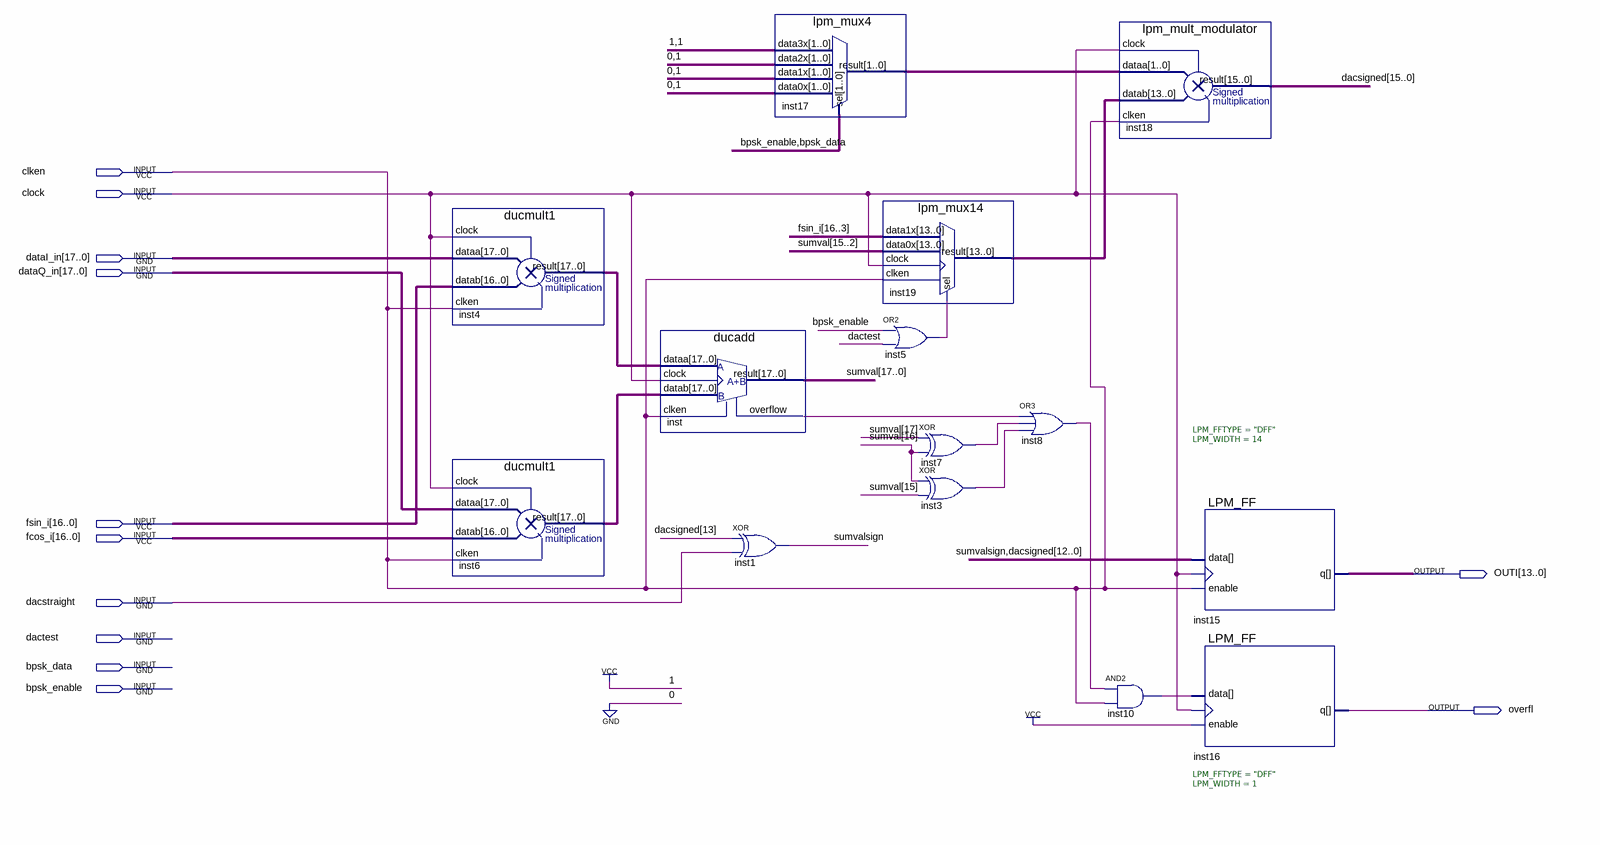
[diagram p0: schematic sheet]
// Quartus schematic duc_mux.bdf as structural Verilog: 14 symbols, 12 pins
module duc_mux (
  input  clken,
  input  clock,
  input  [17:0] dataI_in,
  input  [17:0] dataQ_in,
  input  [16:0] fsin_i,
  input  [16:0] fcos_i,
  input  dacstraight,
  input  dactest,
  input  bpsk_data,
  input  bpsk_enable,
  output [13:0] OUTI,
  output overfl
);

  wire inst3_out, inst5_out, inst7_out, inst8_out, inst10_out, inst_overflow, sumvalsign;
  wire [1:0] inst17_result;
  wire [13:0] inst19_result;
  wire [15:0] dacsigned;
  wire [17:0] inst4_result, inst6_result, sumval;

  ducmult1 inst4 (.clock(clock), .dataa(dataI_in), .datab(fsin_i), .clken(clken), .result(inst4_result));
  ducmult1 inst6 (.clock(clock), .dataa(dataQ_in), .datab(fcos_i), .clken(clken), .result(inst6_result));
  ducadd inst (
    .dataa(inst4_result), .datab(inst6_result), .clken(clken), .clock(clock), .result(sumval),
    .overflow(inst_overflow));
  lpm_mux4 inst17 (
    .data3x(2'b11), .data2x(2'b01), .data1x(2'b01), .data0x(2'b01), .sel({bpsk_enable, bpsk_data}),
    .result(inst17_result));
  xor inst1 (sumvalsign, dacsigned[13], dacstraight);
  lpm_mux14 inst19 (
    .data1x(fsin_i[16:3]), .data0x(sumval[15:2]), .clock(clock), .clken(clken), .sel(inst5_out),
    .result(inst19_result));
  or inst5 (inst5_out, bpsk_enable, dactest);
  xor inst7 (inst7_out, sumval[17], sumval[16]);
  xor inst3 (inst3_out, sumval[16], sumval[15]);
  or inst8 (inst8_out, inst_overflow, inst7_out, inst3_out);
  lpm_mult_modulator inst18 (
    .clock(clock), .dataa(inst17_result), .datab(inst19_result), .clken(clken), .result(dacsigned));
  and inst10 (inst10_out, inst8_out, clken);
  LPM_FF #(.LPM_FFTYPE("DFF"), .LPM_WIDTH(14)) inst15 (
    .clock(clock), .data({sumvalsign, dacsigned[12:0]}), .enable(clken), .q(OUTI));
  LPM_FF #(.LPM_FFTYPE("DFF"), .LPM_WIDTH(1)) inst16 (.clock(clock), .data(inst10_out), .enable(1'b1), .q(overfl));
endmodule
